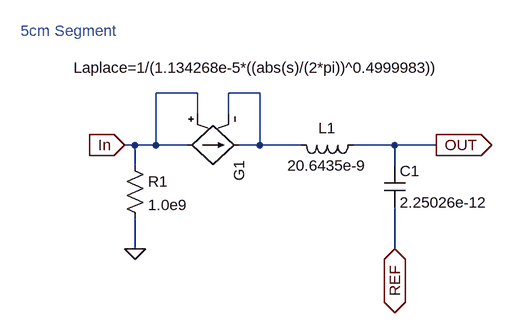
[diagram p0: schematic PanduitCable18AWG-5cm.asc]
PanduitCable18AWG-5cm.asc, the LTspice schematic file:
Version 4
SHEET 1 880 704
WIRE -96 -64 -160 -64
WIRE 0 -64 -48 -64
WIRE -96 -32 -96 -64
WIRE -48 -32 -48 -64
WIRE -192 16 -208 16
WIRE -160 16 -160 -64
WIRE -160 16 -192 16
WIRE -112 16 -160 16
WIRE 0 16 0 -64
WIRE 0 16 -32 16
WIRE 64 16 0 16
WIRE 208 16 144 16
WIRE 272 16 208 16
WIRE -192 48 -192 16
WIRE 208 48 208 16
WIRE -192 176 -192 128
WIRE 208 176 208 112
FLAG -208 16 In
IOPIN -208 16 In
FLAG 272 16 OUT
IOPIN 272 16 Out
FLAG 208 176 REF
IOPIN 208 176 BiDir
FLAG -192 176 0
SYMBOL ind 160 0 R90
WINDOW 0 5 56 VBottom 2
WINDOW 3 32 56 VTop 2
SYMATTR InstName L1
SYMATTR Value 20.6435e-9
SYMBOL cap 192 48 R0
SYMATTR InstName C1
SYMATTR Value 2.25026e-12
SYMBOL g2 -16 16 R90
WINDOW 3 -119 -302 VRight 2
SYMATTR InstName G1
SYMATTR Value Laplace=1/(1.134268e-5*((abs(s)/(2*pi))^0.4999983))
SYMBOL res -208 32 R0
SYMATTR InstName R1
SYMATTR Value 1.0e9
TEXT -368 -160 Left 2 ;5cm Segment

The netlist it stands for:
* PanduitCable18AWG-5cm.asc
L1 OUT N001 20.6435e-9
C1 OUT REF 2.25026e-12
G1 In N001 In N001 Laplace=1/(1.134268e-5*((abs(s)/(2*pi))^0.4999983))
R1 In 0 1.0e9
* 5cm Segment
.backanno
.end